# Altium project USBDM_Kinetis.PrjPcb
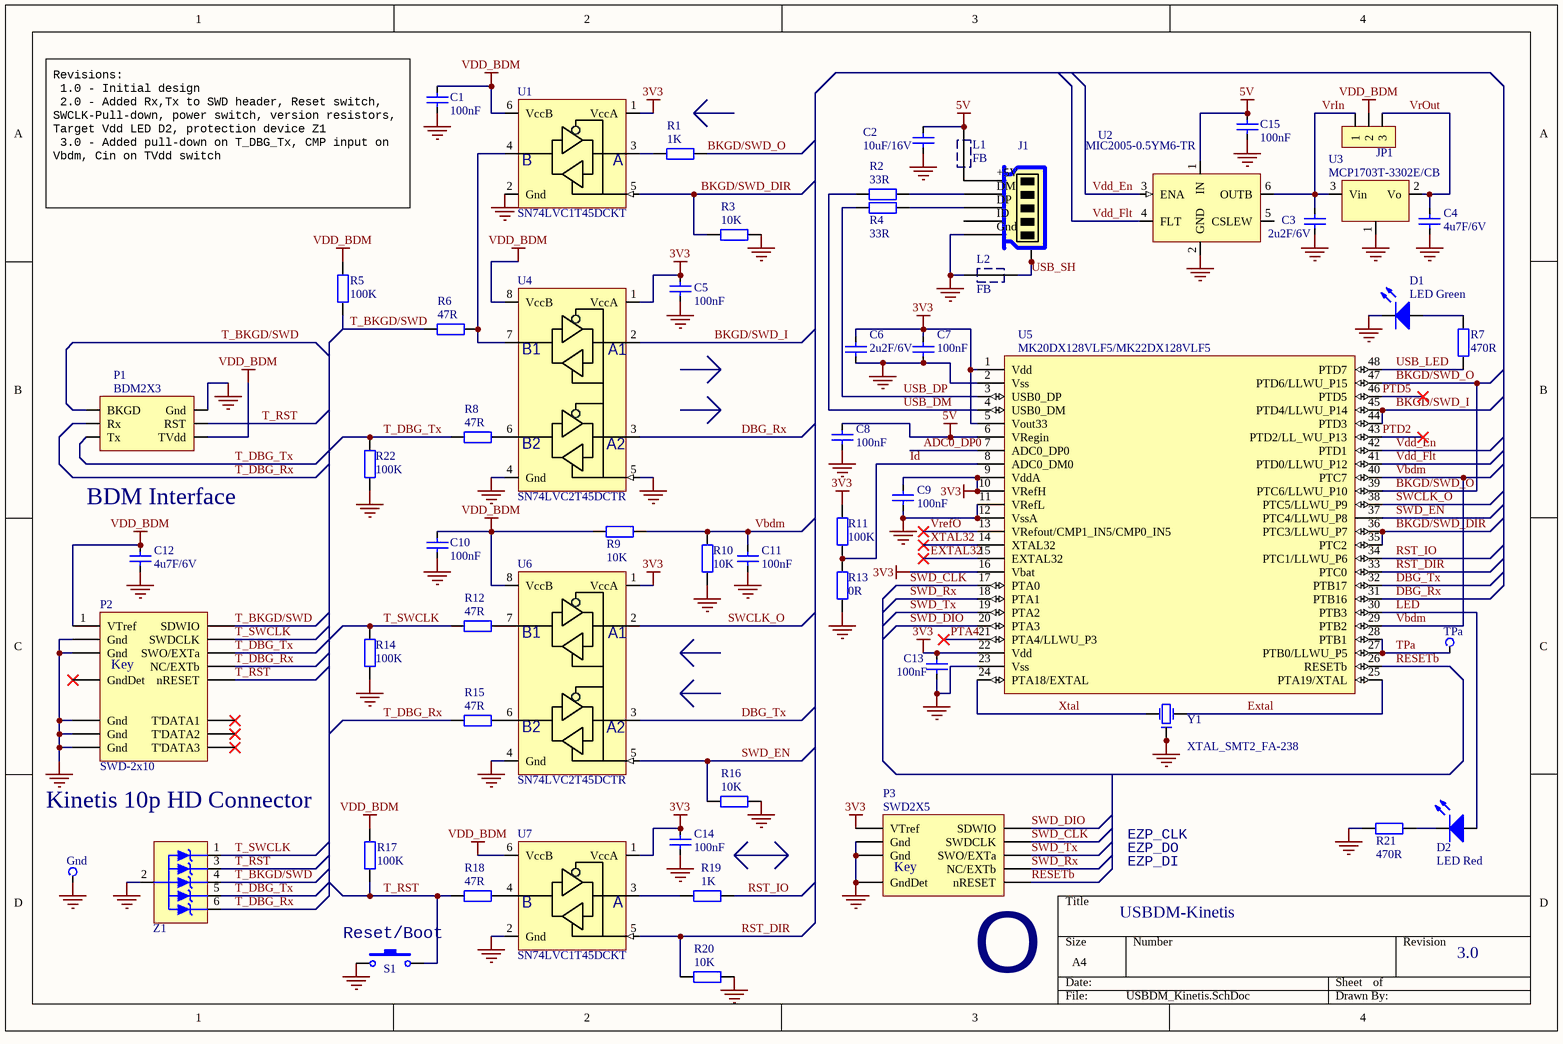
[diagram p0: USBDM_Kinetis.SchDoc]
1 sheet, 59 parts. Net scope: global (net labels, ports and power ports of the same name join across sheets).
Board file: USBDM_Kinetis.PcbDoc

## Sheet USBDM_Kinetis.SchDoc: USBDM-Kinetis
size A4; Revision: 3.0

### Parts
C1  100nF  [CCNP1608-0603]
C2  10uF/16V  [CCNP2012-0805]
C3  2u2F/6V  [CCNP1608-0603]
C4  4u7F/6V  [CCNP1608-0603]
C5  100nF  [CCNP1608-0603]
C6  2u2F/6V  [CCNP1608-0603]
C7  100nF  [CCNP1608-0603]
C8  100nF  [CCNP1608-0603]
C9  100nF  [CCNP1608-0603]
C10  100nF  [CCNP1608-0603]
C11  100nF  [CCNP1608-0603]
C12  4u7F/6V  [CCNP1608-0603]
C13  100nF  [CCNP1608-0603]
C14  100nF  [CCNP1608-0603]
C15  100nF  [CCNP1608-0603]
D1  LED Green  [LED1608-0603-GREEN]
D2  LED Red  [LED1608-0603-RED]
Gnd  TP  [PCBPIN - 0.9mm]  (value not drawn)  (no BOM)
J1  USB_MICRO_B_CONNECTOR  [MOLEX - 47346-0001]  (value not drawn)
JP1  Header 1x3 2mm  [Header 1x3 (2mm)]  (value not drawn)
L1  FB  [CR2012-0805]
L2  FB  [CR2012-0805]
Logo1  OSHW Logo  [OSHW]  (value not drawn)  (no BOM)
P1  BDM2X3  [BDM]
P2  SWD-2x10  [SWD-2x10 - reduced]
P3  SWD2X5  [SWD-2x5]
R1  1K  [CR1608-0603]
R2  33R  [CR1608-0603]
R3  10K  [CR1608-0603]
R4  33R  [CR1608-0603]
R5  100K  [CR1608-0603]
R6  47R  [CR1608-0603]
R7  470R  [CR1608-0603]
R8  47R  [CR1608-0603]
R9  10K  [CR1608-0603]
R10  10K  [CR1608-0603]
R11  100K  [CR1608-0603]
R12  47R  [CR1608-0603]
R13  0R  [CR1608-0603]
R14  100K  [CR1608-0603]
R15  47R  [CR1608-0603]
R16  10K  [CR1608-0603]
R17  100K  [CR1608-0603]
R18  47R  [CR1608-0603]
R19  1K  [CR1608-0603]
R20  10K  [CR1608-0603]
R21  470R  [CR1608-0603]
R22  100K  [CR1608-0603]
S1  SW-PB-SMT-B3U-1000P-B  [SW_SMT_PB2-B3U-1000P-B]  (value not drawn)
TPa  TP  [PCBPIN - 0.9mm]  (value not drawn)  (no BOM)
U1  SN74LVC1T45DCKT  [SC70_N]
U2  MIC2005-0.5YM6-TR  [SOT23-6-Power]
U3  MCP1703T-3302E/CB  [SOT23]
U4  SN74LVC2T45DCTR  [SSOP8_N]
U5  MK20DX128VLF5/MK22DX128VLF5  [TSQFP50P900X900-48L]
U6  SN74LVC2T45DCTR  [SSOP8_N]
U7  SN74LVC1T45DCKT  [SC70_N]
Y1  XTAL_SMT2_FA-238  [Crystal_SMT - EPSON-FA-238]
Z1  82402305  [SOT23-6]  (value not drawn)

### Nets
3V3: C5.2 C6.2 C7.2 C9.2 C13.2 C14.2 P3.1(VTref) R11.2 U1.1(VccA) U4.1(VccA) U5.1(Vdd) U5.5(Vout33) U5.9(VddA) U5.10(VRefH) U5.16(Vbat) U5.22(Vdd) U6.1(VccA) U7.1(VccA)
5V: C2.2 C8.2 C15.1 L1.2 U2.1(IN) U5.6(VRegin)
GND: C1.1 C2.1 C3.1 C4.1 C5.1 C6.1 C7.1 C8.1 C9.1 C10.1 C11.1 C12.1 C13.1 C14.1 C15.2 D1.K Gnd.1(TP) J1.G(USBGnd) L2.2 P1.2(Gnd) P2.3(Gnd) P2.5(Gnd) P2.15(Gnd) P2.17(Gnd) P2.19(Gnd) P3.3(Gnd) P3.5(Gnd) P3.9(GndDet) R3.2 R10.2 R13.1 R14.1 R16.2 R20.2 R21.1 R22.1 S1.1 U1.2(Gnd) U2.2(GND) U3.1(Gnd) U4.4(Gnd) U4.5(DIR) U5.2(Vss) U5.11(VRefL) U5.12(VssA) U5.23(Vss) U6.4(Gnd) U7.2(Gnd) Y1.2(Gnd) Y1.4(Gnd) Z1.2
VDD_BDM: C1.2 C10.2 C12.2 JP1.2 P1.6(TVdd) P2.1(VTref) R5.1 R9.2 R17.1 U1.6(VccB) U4.8(VccB) U6.8(VccB) U7.6(VccB)
ADC0_DP0: U5.7(ADC0_DP0)
BKGD/SWD_DIR: R3.1 U1.5(DIR) U5.35(PTC2) U5.36(PTC3/LLWU_P7)
BKGD/SWD_I: U4.2(A1) U5.44(PTD3) U5.45(PTD4/LLWU_P14)
BKGD/SWD_O: R1.1 U5.39(PTC6/LLWU_P10) U5.47(PTD6/LLWU_P15)
DBG_Rx: U4.3(A2) U5.31(PTB16)
DBG_Tx: U5.32(PTB17) U6.3(A2)
Extal: U5.25(PTA19/XTAL) Y1.3(OSC2)
EXTAL32: U5.15(EXTAL32)
Id: R11.1 R13.2 U5.8(ADC0_DM0)
LED: D2.A U5.30(PTB3)
PTA4: U5.21(PTA4/LLWU_P3)
PTD2: U5.43(PTD2/LL_WU_P13)
PTD5: U5.46(PTD5)
RESETb: P3.10(nRESET) U5.26(RESETb)
RST_DIR: R20.1 U5.33(PTC0) U7.5(DIR)
RST_IO: R19.1 U5.34(PTC1/LLWU_P6)
SWCLK_O: U5.38(PTC5/LLWU_P9) U6.2(A1)
SWD_CLK: P3.4(SWDCLK) U5.17(PTA0)
SWD_DIO: P3.2(SDWIO) U5.20(PTA3)
SWD_EN: R16.1 U5.37(PTC4/LLWU_P8) U6.5(DIR)
SWD_Rx: P3.8(NC/EXTb) U5.18(PTA1)
SWD_Tx: P3.6(SWO/EXTa) U5.19(PTA2)
T_BKGD/SWD: P1.1(BKGD) P2.2(SDWIO) R5.2 R6.2 Z1.4
T_DBG_Rx: P1.3(Rx) P2.8(NC/EXTb) R15.2 Z1.6
T_DBG_Tx: P1.5(Tx) P2.6(SWO/EXTa) R8.2 R22.2 Z1.5
T_RST: P1.4(RST) P2.10(nRESET) R17.2 R18.2 S1.2 Z1.3
T_SWCLK: P2.4(SWDCLK) R12.2 R14.2 Z1.1
TPa: TPa.1(TP) U5.27(PTB0/LLWU_P5) U5.28(PTB1)
USB_DM: R2.2 U5.4(USB0_DM)
USB_DP: R4.2 U5.3(USB0_DP)
USB_LED: R7.2 U5.48(PTD7)
USB_SH: J1.S1(USBShd) J1.S2(USBShd) J1.S3(USBShd) J1.S4(USBShd) J1.S5(USBShd) J1.S6(USBShd) L2.1
Vbdm: C11.2 R9.1 R10.1 U5.29(PTB2) U5.40(PTC7)
Vdd_En: U2.3(ENA) U5.42(PTD1)
Vdd_Flt: U2.4(FLT) U5.41(PTD0/LLWU_P12)
VrefO: U5.13(VRefout/CMP1_IN5/CMP0_IN5)
VrIn: C3.2 JP1.1 U2.6(OUTB) U3.3(Vin)
VrOut: C4.2 JP1.3 U3.2(Vo)
Xtal: U5.24(PTA18/EXTAL) Y1.1(OSC1)
XTAL32: U5.14(XTAL32)
NetD1_A: D1.A R7.1
NetD2_K: D2.K R21.2
NetJ1_D+: J1.D+(USBDP) R4.1
NetJ1_D-: J1.D-(USBDM) R2.1
NetJ1_VBUS: J1.VBUS(USB+5v) L1.1
NetR1_2: R1.2 U1.3(A)
NetR6_1: R6.1 U1.4(B) U4.7(B1)
NetR8_1: R8.1 U4.6(B2)
NetR12_1: R12.1 U6.7(B1)
NetR15_1: R15.1 U6.6(B2)
NetR18_1: R18.1 U7.4(B)
NetR19_2: R19.2 U7.3(A)

Not connected (* = marked no-connect by the designer): J1 ID(USB_ID); P2 9(GndDet)* 16(T'DATA1)* 18(T'DATA2)* 20(T'DATA3)*; U2 5(CSLEW)

### Notes on the sheet
- (near C1) Revisions:
  1.0 - Initial design
  2.0 - Added Rx,Tx to SWD header, Reset switch,
  SWCLK-Pull-down, power switch, version resistors,
  Target Vdd LED D2, protection device Z1
  3.0 - Added pull-down on T_DBG_Tx, CMP input on Vbdm, Cin on TVdd switch
- BDM Interface
- Kinetis 10p HD Connector
- EZP_CLK
- EZP_DO
- EZP_DI
- (near S1) Reset/Boot
- (in symbol OSHW Logo) O
- (in symbol SWD2X5) Key
- (in symbol SWD2X10-Reduced) Key
- (in symbol USB_MICRO_B_CONNECTOR) +5V; DM; DP; Gnd

### Library data of the parts
C1 C5 C7-C11 C13-C15 = Cap: Capacitor SMT 0603; Manufacturer: Generic Components; Class: Passive; Published: 08/06/2000; Publisher: Altium Hobart Technology Centre; SubClass: Capacitor; Farnell PN: 1709957; Value: 100nF
  C1 C5 C7-C11 C13 C14: Digikey: *
C2 = Cap_CCNP_0805: Capacitor SMT 0805; Manufacturer: Generic Components; Class: Passive; Published: 08/06/2000; Publisher: Altium Hobart Technology Centre; SubClass: Capacitor; Farnell PN: 2497049; Digikey: *; Value: 10uF/16V
C3 C4 C6 C12 = Cap_CCNP_0603: Capacitor SMT 0603; Manufacturer: Generic Components; Class: Passive; Published: 08/06/2000; Publisher: Altium Hobart Technology Centre; SubClass: Capacitor; Digikey: *
  C3 C6: Farnell PN: 2496850; Value: 2u2F/6V
  C4 C12: Farnell PN: 2496930; Value: 4u7F/6V
D1 = LED-0603-Green: LED 0603 Green; Manufacturer: Generic Components; Class I: Optoelectronic; Published: 8-Jun-2000; Revision: July-2002: Re-released for DXP Platform.; Publisher: Altium Limited; Class II: LED; Farnell PN: 5790852; Digikey: *
D2 = LED-0603-Red: LED 0603 Red; Manufacturer: Generic Components; Class I: Optoelectronic; Published: 8-Jun-2000; Revision: July-2002: Re-released for DXP Platform.; Publisher: Altium Limited; Class II: LED; Farnell PN: 5790852; Digikey: *
Gnd TPa = TP: Test Point; Digikey: *; Farnell PN: *
J1 = USB_MICRO_B_CONNECTOR: USB Micro-B Connector; Farnell PN: 1568026; Digikey: *
JP1 = Header 1x3 2mm: Header, 1x3, 2mm; Manufacturer: Generic Components; Class I: Connector; Revision: July-2002: Re-released for DXP Platform.; Publisher: Altium Limited; Digikey: *; Farnell PN: *
L1 L2 = Ferrite Bead 0805: Ferrite Bead (0805) 0.045OHM, 2A; Farnell PN: 1515661; Digikey: *
P2 = SWD2X10-Reduced: SWD Connector 2x10-Pin; LatestRevisionDate: 17-Jul-2002; LatestRevisionNote: Re-released for DXP Platform.; Publisher: Altium Limited; Farnell PN: 1865289
P3 = SWD2X5: SWD Connector 2x5-Pin; LatestRevisionDate: 17-Jul-2002; LatestRevisionNote: Re-released for DXP Platform.; Publisher: Altium Limited; Farnell PN: 1865285
R1-R10 R12 R14-R22 = Res: Resistor SMT 0603; Manufacturer: Generic Components; Class: Passive; Published: 08/06/2000; Publisher: Altium Hobart Technology Centre; SubClass: Resistor
  R1 R19: Value: 1K; Farnell PN: 2331727; Digikey: *
  R2 R4: Farnell PN: 1632431; Digikey: *; Value: 33R
  R3 R9 R10 R16 R20: Value: 10K; Farnell PN: 1632490; Digikey: *
  R5: Value: 100K; Farnell PN: 9332405; Digikey: *
  R6 R8 R12 R15 R18: Value: 47R; Farnell PN: 1646283; Digikey: *
  R7 R21: Value: 470R; Farnell PN: 2073508; Digikey: *
  R14 R17 R22: Value: 100K; Farnell PN: 9332405
R11 R13 = Res_CR0603: Resistor SMT 0603; Manufacturer: Generic Components; Class: Passive; Published: 08/06/2000; Publisher: Altium Hobart Technology Centre; SubClass: Resistor; Digikey: *
  R11: Farnell PN: 9332405; Value: 100K
  R13: Farnell PN: 1631319; Value: 0R
S1 = SW-PB-SMT-B3U-1000P-B: Switch OMRON B3U series; Manufacturer: Generic Components; Published: 24-Mar-1999; Revision: July-2002: Re-released for DXP Platform.; Publisher: Altium Limited; Digikey: *; Farnell PN: 1333654
U1 U7 = SN74LVC1T45DCKT: Dual voltage bidirection buffer; Digikey: *; Farnell PN: 2395603
U2 = MIC2005-0.5YM6-TR: Power Switch; Farnell PN: 2509880; Digikey: *
U3 = MCP1703T-3302E/CB: 3V3 LDO regulator; Farnell PN: 2136813
U4 U6 = SN74LVC2T45DCTR: Dual voltage bidirection buffer; Digikey: *; Farnell PN: 2008640
U5 = MK20DX128VLF5: Arm Cortex M4; Farnell PN: 2133571
Y1 = XTAL_SMT2_FA-238: Crystal (EPSON  Q22FA23800065 FA-238 24 MHZ 12.0PF); Manufacturer: Generic Components; Class: Oscillator; SubClass: Crystal Oscillator; Published: 08/06/2000; Publisher: Altium Hobart Technology Centre; Digikey: *; Farnell PN: 1712815
Z1 = 82402305: Quintuple Unipolar Protection Device (5V); Digikey: *; Farnell PN: 1825866